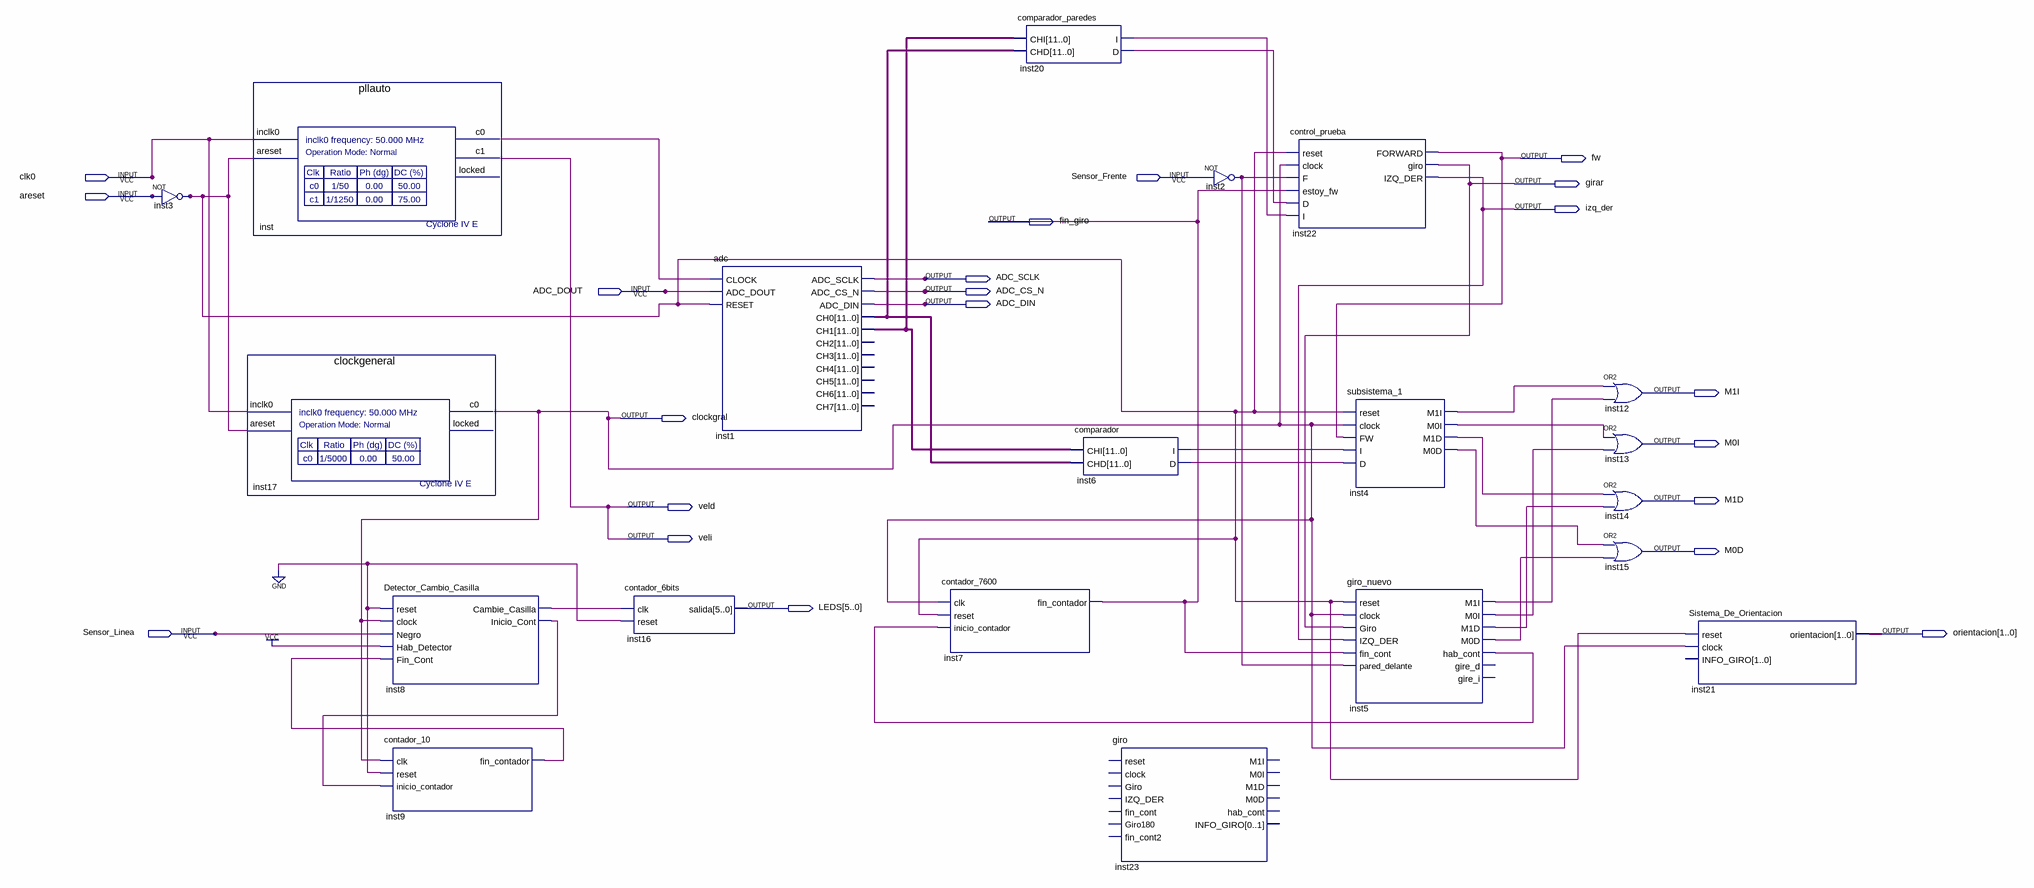
[diagram p0: schematic sheet]
// Quartus schematic Main_prueba.bdf as structural Verilog: 20 symbols, 21 pins
module Main_prueba (
  input  clk0,
  input  Sensor_Frente,
  input  areset,
  input  ADC_DOUT,
  input  Sensor_Linea,
  output fw,
  output girar,
  output izq_der,
  output fin_giro,
  output ADC_SCLK,
  output ADC_CS_N,
  output ADC_DIN,
  output M1I,
  output clockgral,
  output M0I,
  output M1D,
  output veld,
  output veli,
  output M0D,
  output [5:0] LEDS,
  output [1:0] orientacion
);

  wire inst2_out, inst3_out, inst4_m0d, inst4_m0i, inst4_m1d, inst4_m1i, inst5_hab_cont, inst5_m0d,
       inst5_m0i, inst5_m1d, inst5_m1i, inst6_d, inst6_i, inst8_cambie_casilla, inst8_inicio_cont,
       inst9_fin_contador, inst20_d, inst20_i, inst_c0;
  wire [11:0] inst1_ch0, inst1_ch1;

  not inst3 (inst3_out, areset);
  pllauto inst (.inclk0(clk0), .areset(inst3_out), .c0(inst_c0), .c1(veld));  // open: locked
  clockgeneral inst17 (.inclk0(clk0), .areset(inst3_out), .c0(clockgral));  // open: locked
  Detector_Cambio_Casilla inst8 (
    .reset(1'b0), .clock(clockgral), .Negro(Sensor_Linea), .Hab_Detector(1'b1),
    .Fin_Cont(inst9_fin_contador), .Cambie_Casilla(inst8_cambie_casilla), .Inicio_Cont(inst8_inicio_cont));
  contador_10 inst9 (
    .clk(clockgral), .reset(1'b0), .inicio_contador(inst8_inicio_cont), .fin_contador(inst9_fin_contador));
  contador_6bits inst16 (.clk(inst8_cambie_casilla), .reset(1'b0), .salida(LEDS));
  adc inst1 (
    .CLOCK(inst_c0), .ADC_DOUT(ADC_DOUT), .RESET(inst3_out), .ADC_SCLK(ADC_SCLK), .ADC_CS_N(ADC_CS_N),
    .ADC_DIN(ADC_DIN), .CH0(inst1_ch0), .CH1(inst1_ch1));  // open: CH2, CH3, CH4, CH5, CH6, CH7
  contador_7600 inst7 (.clk(clockgral), .reset(inst3_out), .inicio_contador(inst5_hab_cont), .fin_contador(fin_giro));
  comparador_paredes inst20 (.CHI(inst1_ch1), .CHD(inst1_ch0), .I(inst20_i), .D(inst20_d));
  comparador inst6 (.CHI(inst1_ch1), .CHD(inst1_ch0), .I(inst6_i), .D(inst6_d));
  giro inst23 ();  // open: reset, clock, Giro, IZQ_DER, fin_cont, Giro180, fin_cont2, M1I, M0I, M1D, M0D, hab_cont, INFO_GIRO
  not inst2 (inst2_out, Sensor_Frente);
  control_prueba inst22 (
    .reset(inst3_out), .clock(clockgral), .F(inst2_out), .estoy_fw(fin_giro), .D(inst20_d), .I(inst20_i),
    .FORWARD(fw), .giro(girar), .IZQ_DER(izq_der));
  subsistema_1 inst4 (
    .reset(inst3_out), .clock(clockgral), .FW(fw), .I(inst6_i), .D(inst6_d), .M1I(inst4_m1i),
    .M0I(inst4_m0i), .M1D(inst4_m1d), .M0D(inst4_m0d));
  giro_nuevo inst5 (
    .reset(inst3_out), .clock(clockgral), .Giro(girar), .IZQ_DER(izq_der), .fin_cont(fin_giro),
    .pared_delante(inst2_out), .M1I(inst5_m1i), .M0I(inst5_m0i), .M1D(inst5_m1d), .M0D(inst5_m0d),
    .hab_cont(inst5_hab_cont));  // open: gire_d, gire_i
  or inst12 (M1I, inst4_m1i, inst5_m1i);
  or inst13 (M0I, inst4_m0i, inst5_m0i);
  or inst14 (M1D, inst4_m1d, inst5_m1d);
  or inst15 (M0D, inst4_m0d, inst5_m0d);
  Sistema_De_Orientacion inst21 (.reset(inst3_out), .clock(clockgral), .orientacion(orientacion));  // open: INFO_GIRO

  assign veli = veld;
endmodule
